# Altium schematic sheet FPGA Power.SCHDOC: FPGA Rack
size 420 x 297 mm; DrawnBy: zas; Revision: V1.0; SheetNumber: 4; SheetTotal: 25; DocumentName: FPGA Power.SCHDOC
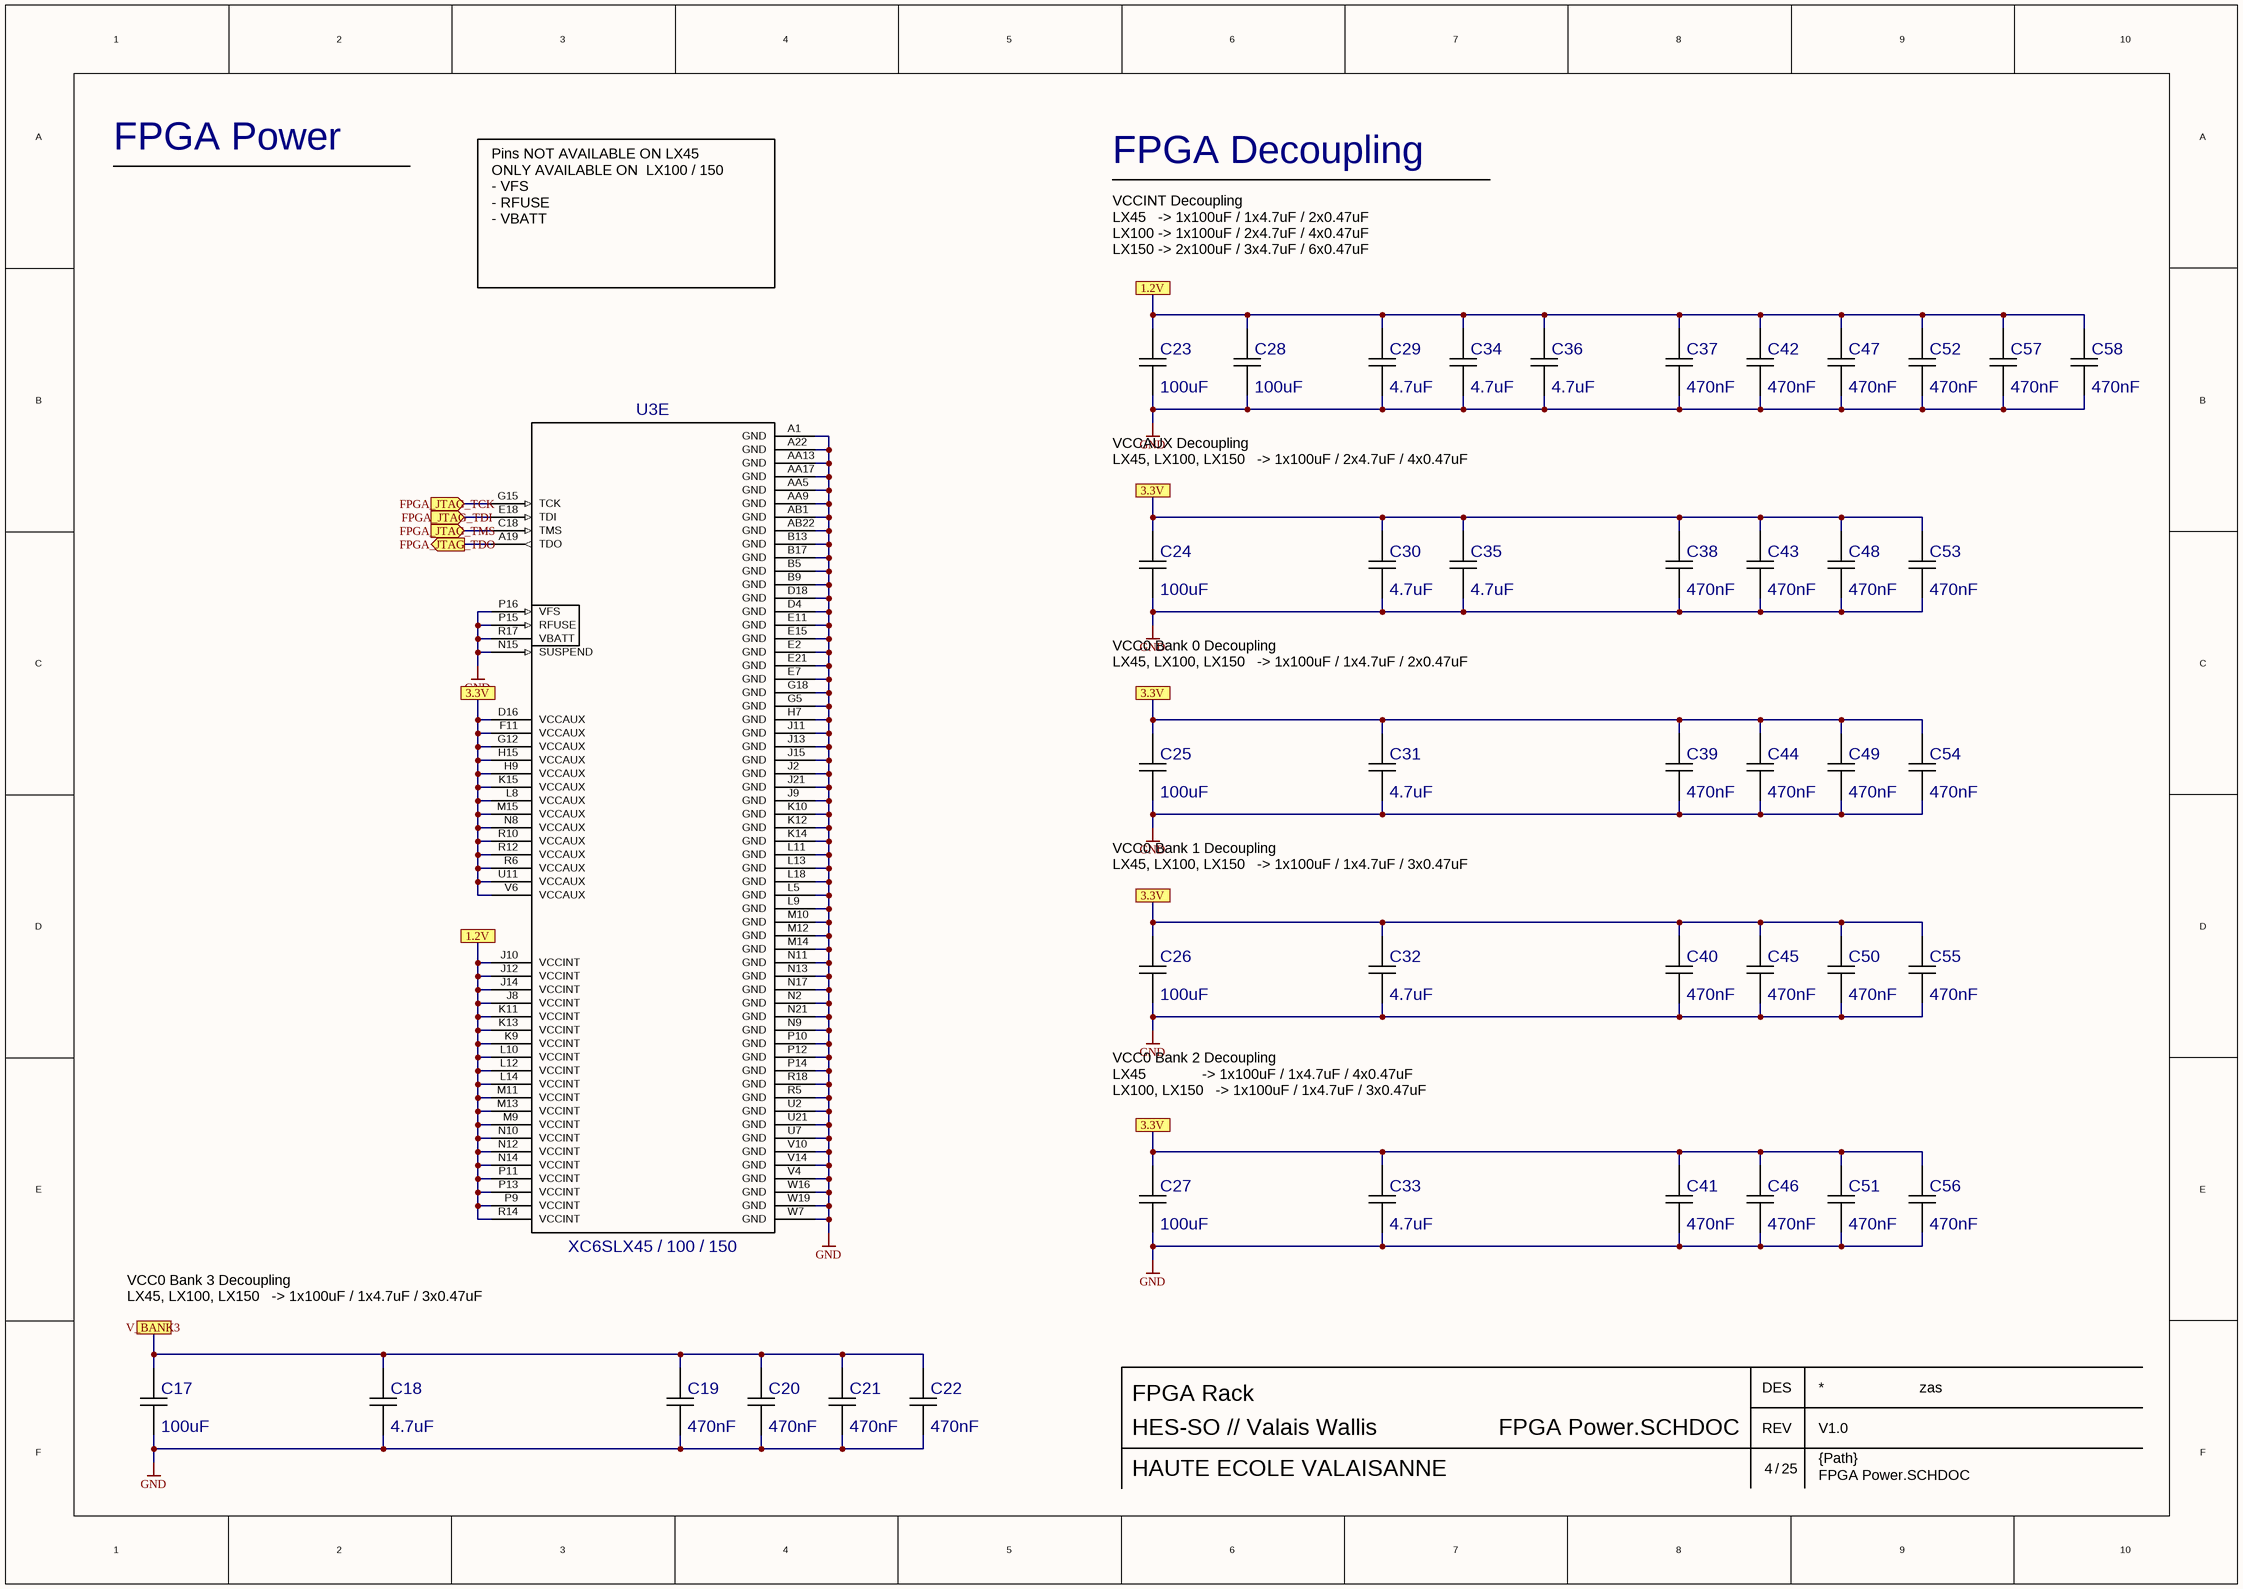
[diagram p0: FPGA Power.SCHDOC]

## Parts
C17  value 100uF  [CC1206-MM]  (hidden comment: CAPS1206-MM)
C18  value 4.7uF  [CC0805-MM]  (hidden comment: CAPS0805-MM)
C19  value 470nF  [RC0603-MM]  (hidden comment: CAPS0603-MM)
C20  value 470nF  [RC0603-MM]  (hidden comment: CAPS0603-MM)
C21  value 470nF  [RC0603-MM]  (hidden comment: CAPS0603-MM)
C22  value 470nF  [RC0603-MM]  (hidden comment: CAPS0603-MM)
C23  value 100uF  [CC1206-MM]  (hidden comment: CAPS1206-MM)
C24  value 100uF  [CC1206-MM]  (hidden comment: CAPS1206-MM)
C25  value 100uF  [CC1206-MM]  (hidden comment: CAPS1206-MM)
C26  value 100uF  [CC1206-MM]  (hidden comment: CAPS1206-MM)
C27  value 100uF  [CC1206-MM]  (hidden comment: CAPS1206-MM)
C28  value 100uF  [CC1206-MM]  (hidden comment: CAPS1206-MM)
C29  value 4.7uF  [CC0805-MM]  (hidden comment: CAPS0805-MM)
C30  value 4.7uF  [CC0805-MM]  (hidden comment: CAPS0805-MM)
C31  value 4.7uF  [CC0805-MM]  (hidden comment: CAPS0805-MM)
C32  value 4.7uF  [CC0805-MM]  (hidden comment: CAPS0805-MM)
C33  value 4.7uF  [CC0805-MM]  (hidden comment: CAPS0805-MM)
C34  value 4.7uF  [CC0805-MM]  (hidden comment: CAPS0805-MM)
C35  value 4.7uF  [CC0805-MM]  (hidden comment: CAPS0805-MM)
C36  value 4.7uF  [CC0805-MM]  (hidden comment: CAPS0805-MM)
C37  value 470nF  [RC0603-MM]  (hidden comment: CAPS0603-MM)
C38  value 470nF  [RC0603-MM]  (hidden comment: CAPS0603-MM)
C39  value 470nF  [RC0603-MM]  (hidden comment: CAPS0603-MM)
C40  value 470nF  [RC0603-MM]  (hidden comment: CAPS0603-MM)
C41  value 470nF  [RC0603-MM]  (hidden comment: CAPS0603-MM)
C42  value 470nF  [RC0603-MM]  (hidden comment: CAPS0603-MM)
C43  value 470nF  [RC0603-MM]  (hidden comment: CAPS0603-MM)
C44  value 470nF  [RC0603-MM]  (hidden comment: CAPS0603-MM)
C45  value 470nF  [RC0603-MM]  (hidden comment: CAPS0603-MM)
C46  value 470nF  [RC0603-MM]  (hidden comment: CAPS0603-MM)
C47  value 470nF  [RC0603-MM]  (hidden comment: CAPS0603-MM)
C48  value 470nF  [RC0603-MM]  (hidden comment: CAPS0603-MM)
C49  value 470nF  [RC0603-MM]  (hidden comment: CAPS0603-MM)
C50  value 470nF  [RC0603-MM]  (hidden comment: CAPS0603-MM)
C51  value 470nF  [RC0603-MM]  (hidden comment: CAPS0603-MM)
C52  value 470nF  [RC0603-MM]  (hidden comment: CAPS0603-MM)
C53  value 470nF  [RC0603-MM]  (hidden comment: CAPS0603-MM)
C54  value 470nF  [RC0603-MM]  (hidden comment: CAPS0603-MM)
C55  value 470nF  [RC0603-MM]  (hidden comment: CAPS0603-MM)
C56  value 470nF  [RC0603-MM]  (hidden comment: CAPS0603-MM)
C57  value 470nF  [RC0603-MM]  (hidden comment: CAPS0603-MM)
C58  value 470nF  [RC0603-MM]  (hidden comment: CAPS0603-MM)
U3  value XC6SLX45 / 100 / 150  [BGA23X23-FG484]  (hidden comment: XC6SLX150 FGG484)  (part E of 5)

## Ports
1.2V, 3.3V, FPGA_JTAG_TCK (in), FPGA_JTAG_TDI (in), FPGA_JTAG_TDO (out), FPGA_JTAG_TMS (in), V_BANK3

## Nets
GND: C17.1 C18.1 C19.1 C20.1 C21.1 C22.1 C23.1 C24.1 C25.1 C26.1 C27.1 C28.1 C29.1 C30.1 C31.1 C32.1 C33.1 C34.1 C35.1 C36.1 C37.1 C38.1 C39.1 C40.1 C41.1 C42.1 C43.1 C44.1 C45.1 C46.1 C47.1 C48.1 C49.1 C50.1 C51.1 C52.1 C53.1 C54.1 C55.1 C56.1 C57.1 C58.1 U3.A1(GND) U3.A22(GND) U3.AA5(GND) U3.AA9(GND) U3.AA13(GND) U3.AA17(GND) U3.AB1(GND) U3.AB22(GND) U3.B5(GND) U3.B9(GND) U3.B13(GND) U3.B17(GND) U3.D4(GND) U3.D18(GND) U3.E2(GND) U3.E7(GND) U3.E11(GND) U3.E15(GND) U3.E21(GND) U3.G5(GND) U3.G18(GND) U3.H7(GND) U3.J2(GND) U3.J9(GND) U3.J11(GND) U3.J13(GND) U3.J15(GND) U3.J21(GND) U3.K10(GND) U3.K12(GND) U3.K14(GND) U3.L5(GND) U3.L9(GND) U3.L11(GND) U3.L13(GND) U3.L18(GND) U3.M10(GND) U3.M12(GND) U3.M14(GND) U3.N2(GND) U3.N9(GND) U3.N11(GND) U3.N13(GND) U3.N15(SUSPEND) U3.N17(GND) U3.N21(GND) U3.P10(GND) U3.P12(GND) U3.P14(GND) U3.P15(RFUSE) U3.P16(VFS) U3.R5(GND) U3.R17(VBATT) U3.R18(GND) U3.U2(GND) U3.U7(GND) U3.U21(GND) U3.V4(GND) U3.V10(GND) U3.V14(GND) U3.W7(GND) U3.W16(GND) U3.W19(GND)
FPGA_JTAG_TCK: U3.G15(TCK) ; port FPGA_JTAG_TCK
FPGA_JTAG_TDI: U3.E18(TDI) ; port FPGA_JTAG_TDI
FPGA_JTAG_TDO: U3.A19(TDO) ; port FPGA_JTAG_TDO
FPGA_JTAG_TMS: U3.C18(TMS) ; port FPGA_JTAG_TMS
NetC17_2: C17.2 C18.2 C19.2 C20.2 C21.2 C22.2
NetC23_2: C23.2 C28.2 C29.2 C34.2 C36.2 C37.2 C42.2 C47.2 C52.2 C57.2 C58.2
NetC24_2: C24.2 C30.2 C35.2 C38.2 C43.2 C48.2 C53.2
NetC25_2: C25.2 C31.2 C39.2 C44.2 C49.2 C54.2
NetC26_2: C26.2 C32.2 C40.2 C45.2 C50.2 C55.2
NetC27_2: C27.2 C33.2 C41.2 C46.2 C51.2 C56.2
NetU3_D16: U3.D16(VCCAUX) U3.F11(VCCAUX) U3.G12(VCCAUX) U3.H9(VCCAUX) U3.H15(VCCAUX) U3.K15(VCCAUX) U3.L8(VCCAUX) U3.M15(VCCAUX) U3.N8(VCCAUX) U3.R6(VCCAUX) U3.R10(VCCAUX) U3.R12(VCCAUX) U3.U11(VCCAUX) U3.V6(VCCAUX)
NetU3_J8: U3.J8(VCCINT) U3.J10(VCCINT) U3.J12(VCCINT) U3.J14(VCCINT) U3.K9(VCCINT) U3.K11(VCCINT) U3.K13(VCCINT) U3.L10(VCCINT) U3.L12(VCCINT) U3.L14(VCCINT) U3.M9(VCCINT) U3.M11(VCCINT) U3.M13(VCCINT) U3.N10(VCCINT) U3.N12(VCCINT) U3.N14(VCCINT) U3.P9(VCCINT) U3.P11(VCCINT) U3.P13(VCCINT) U3.R14(VCCINT)

## Notes on the sheet
- FPGA Power
- FPGA Decoupling
- Pins NOT AVAILABLE ON LX45
  ONLY AVAILABLE ON  LX100 / 150
  - VFS
  - RFUSE
  - VBATT
- VCCINT Decoupling
  LX45   -> 1x100uF / 1x4.7uF / 2x0.47uF
  LX100 -> 1x100uF / 2x4.7uF / 4x0.47uF
  LX150 -> 2x100uF / 3x4.7uF / 6x0.47uF
- VCCAUX Decoupling
  LX45, LX100, LX150   -> 1x100uF / 2x4.7uF / 4x0.47uF
- VCC0 Bank 0 Decoupling
  LX45, LX100, LX150   -> 1x100uF / 1x4.7uF / 2x0.47uF
- VCC0 Bank 1 Decoupling
  LX45, LX100, LX150   -> 1x100uF / 1x4.7uF / 3x0.47uF
- VCC0 Bank 2 Decoupling
  LX45              -> 1x100uF / 1x4.7uF / 4x0.47uF
  LX100, LX150   -> 1x100uF / 1x4.7uF / 3x0.47uF
- VCC0 Bank 3 Decoupling
  LX45, LX100, LX150   -> 1x100uF / 1x4.7uF / 3x0.47uF
- DES
- HES-SO // Valais Wallis
- HAUTE ECOLE VALAISANNE
- /
- REV
- {Path}

## Library data of the parts
C17 C23-C28 = CAPS1206-MM: Capacitor
C18 C29-C36 = CAPS0805-MM: Capacitor
C19-C22 C37-C58 = CAPS0603-MM: Capacitor